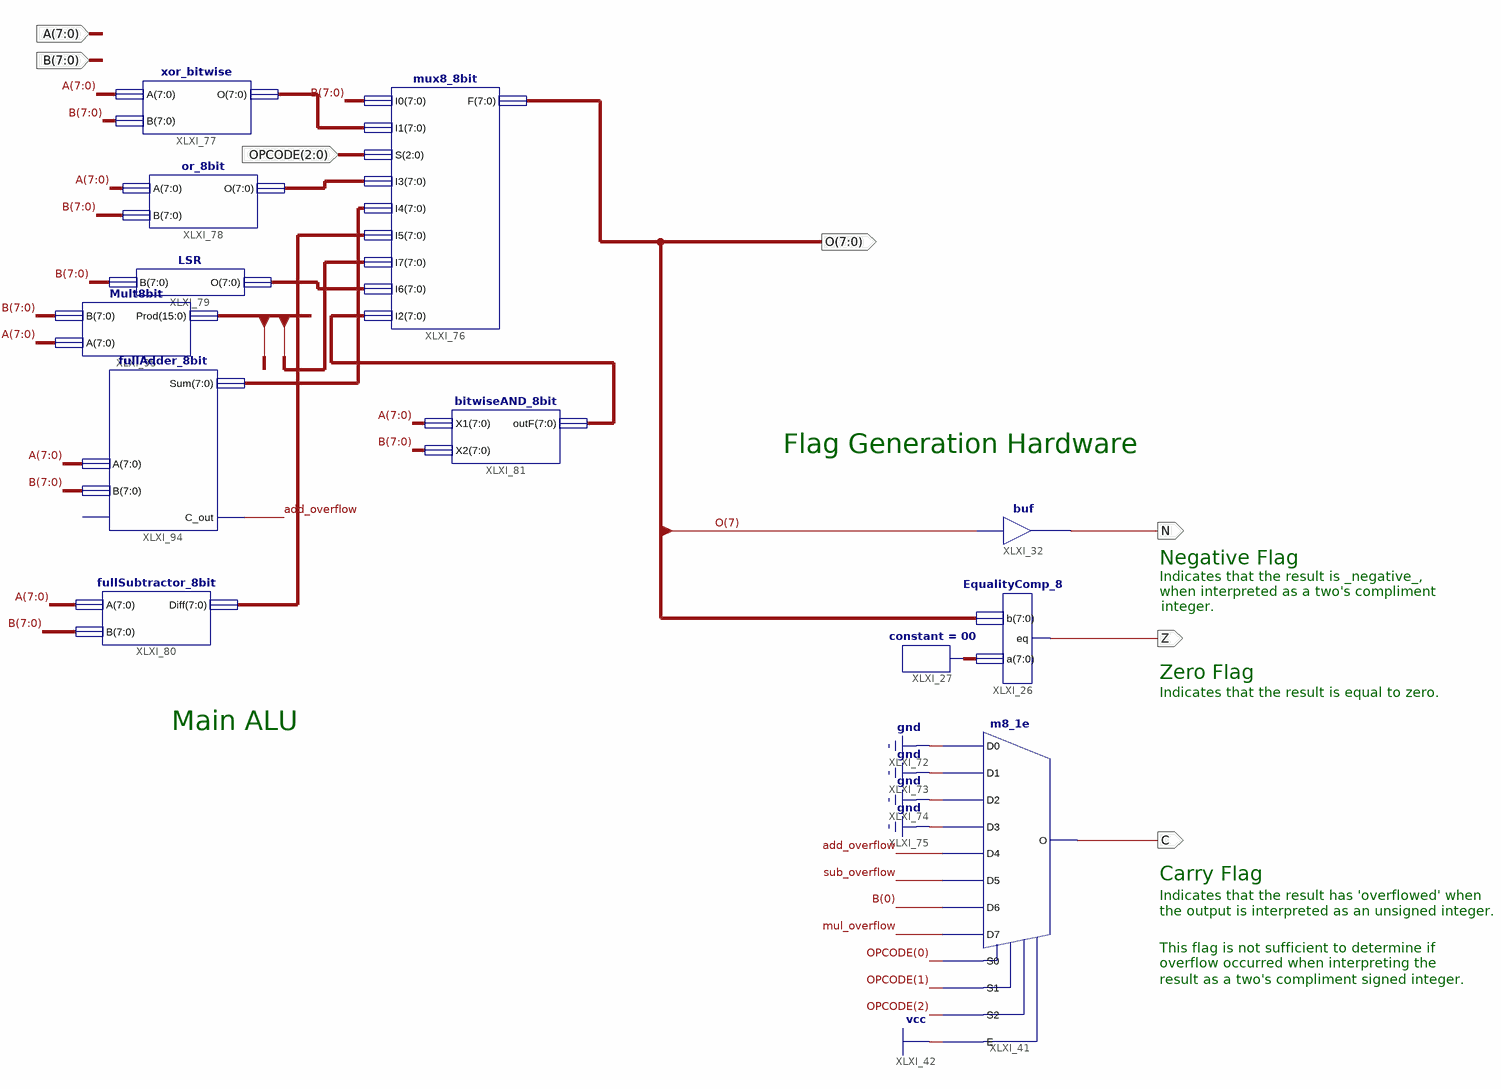
[diagram p0: schematic sheet 1]
// Xilinx ISE schematic ALU.sch (spartan6) as structural Verilog: 12 symbols, 7 ports
module ALU (
  input  [7:0] B,
  input  [7:0] A,
  input  [2:0] OPCODE,
  output [7:0] O,
  output C,
  output Z,
  output N
);

  wire add_overflow, mul_overflow, sub_overflow;
  wire [7:0] XLXN_55, XLXN_175, XLXN_177, XLXN_184, XLXN_190, XLXN_192, XLXN_193;
  wire [15:0] prod;

  EqualityComp_8 XLXI_26 (.a(XLXN_55), .b(O), .eq(Z));
  constant #(.CValue("00")) XLXI_27 (.O(XLXN_55));
  m8_1e XLXI_41 (
    .D0(1'b0), .D1(1'b0), .D2(1'b0), .D3(1'b0), .D4(add_overflow), .D5(sub_overflow), .D6(B[0]),
    .D7(mul_overflow), .E(1'b1), .S0(OPCODE[0]), .S1(OPCODE[1]), .S2(OPCODE[2]), .O(C));
  buf XLXI_32 (N, O[7]);
  mux8_8bit XLXI_76 (
    .I0(B), .I1(XLXN_175), .S(OPCODE), .I3(XLXN_177), .I4(XLXN_190), .I5(XLXN_192), .I7(prod[7:0]),
    .I6(XLXN_184), .I2(XLXN_193), .F(O));
  xor_bitwise XLXI_77 (.A(A), .B(B), .O(XLXN_175));
  or_8bit XLXI_78 (.A(A), .B(B), .O(XLXN_177));
  LSR XLXI_79 (.B(B), .O(XLXN_184));
  bitwiseAND_8bit XLXI_81 (.X1(A), .X2(B), .outF(XLXN_193));
  fullSubtractor_8bit XLXI_80 (.A(A), .B(B), .Diff(XLXN_192));
  Mult8bit XLXI_95 (.B(B), .A(A), .Prod(prod));
  fullAdder_8bit XLXI_94 (.A(A), .B(B), .Sum(XLXN_190), .C_out(add_overflow));  // open: C_in

  // Notes on the sheet:
  //   Flag Generation Hardware
  //   Negative Flag
  //   Indicates that the result is _negative_,
  //   when interpreted as a two's compliment
  //   integer.
  //   Zero Flag
  //   Indicates that the result is equal to zero.
  //   Main ALU
  //   Carry Flag
  //   Indicates that the result has 'overflowed' when
  //   the output is interpreted as an unsigned integer.
  //   This flag is not sufficient to determine if
  //   overflow occurred when interpreting the
  //   result as a two's compliment signed integer.
endmodule
